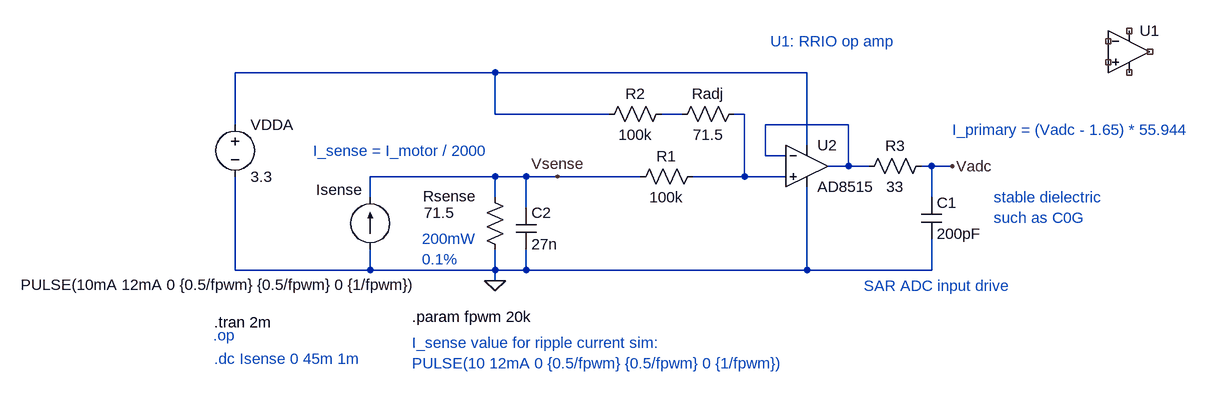
[diagram p0: schematic hallsensor.asc]
hallsensor.asc, the LTspice schematic file:
Version 4
SHEET 1 1144 744
WIRE 48 48 -352 48
WIRE 528 48 48 48
WIRE 48 112 48 48
WIRE 224 112 48 112
WIRE 336 112 304 112
WIRE 432 112 416 112
WIRE -352 128 -352 48
WIRE 592 128 464 128
WIRE 528 160 528 48
WIRE 464 176 464 128
WIRE 496 176 464 176
WIRE 592 192 592 128
WIRE 592 192 560 192
WIRE 624 192 592 192
WIRE 720 192 704 192
WIRE 752 192 720 192
WIRE 48 208 -144 208
WIRE 96 208 48 208
WIRE 144 208 96 208
WIRE 272 208 144 208
WIRE 432 208 432 112
WIRE 432 208 352 208
WIRE 496 208 432 208
WIRE -144 240 -144 208
WIRE 48 240 48 208
WIRE 720 240 720 192
WIRE 96 256 96 208
WIRE -352 352 -352 208
WIRE -144 352 -144 320
WIRE -144 352 -352 352
WIRE 48 352 48 320
WIRE 48 352 -144 352
WIRE 96 352 96 320
WIRE 96 352 48 352
WIRE 528 352 528 224
WIRE 528 352 96 352
WIRE 720 352 720 304
WIRE 720 352 528 352
WIRE 48 368 48 352
FLAG 48 368 0
FLAG 752 192 Vadc
FLAG 144 208 Vsense
SYMBOL current -144 320 R180
WINDOW 0 48 76 Top 2
WINDOW 3 232 -70 Top 2
WINDOW 123 0 0 Left 2
WINDOW 39 0 0 Left 2
SYMATTR InstName Isense
SYMATTR Value PULSE(10mA 12mA 0 {0.5/fpwm} {0.5/fpwm} 0 {1/fpwm})
SYMBOL res 32 224 R0
WINDOW 0 -95 14 Left 2
WINDOW 3 -93 40 Left 2
SYMATTR InstName Rsense
SYMATTR Value 71.5
SYMATTR SpiceLine pwr=0.2
SYMBOL res 368 192 R90
WINDOW 0 0 56 VBottom 2
WINDOW 3 32 56 VTop 2
SYMATTR InstName R1
SYMATTR Value 100k
SYMBOL res 320 96 R90
WINDOW 0 0 56 VBottom 2
WINDOW 3 32 56 VTop 2
SYMATTR InstName R2
SYMATTR Value 100k
SYMBOL res 432 96 R90
WINDOW 0 0 56 VBottom 2
WINDOW 3 32 56 VTop 2
SYMATTR InstName Radj
SYMATTR Value 71.5
SYMBOL voltage -352 112 R0
WINDOW 123 0 0 Left 2
WINDOW 39 0 0 Left 2
SYMATTR InstName VDDA
SYMATTR Value 3.3
SYMBOL Opamps\\UniversalOpamp2 1024 16 R0
SYMATTR InstName U1
SYMATTR Value2 Avol=400k GBW=10Meg Slew=2Meg
SYMATTR SpiceLine ilimit=25m rail=0 Vos=0 phimargin=90
SYMBOL cap 80 256 R0
SYMATTR InstName C2
SYMATTR Value 27n
SYMBOL res 720 176 R90
WINDOW 0 0 56 VBottom 2
WINDOW 3 32 56 VTop 2
SYMATTR InstName R3
SYMATTR Value 33
SYMBOL cap 704 240 R0
SYMATTR InstName C1
SYMATTR Value 200pF
SYMBOL Opamps\\AD8515 528 128 R0
SYMATTR InstName U2
TEXT -384 488 Left 2 ;.dc Isense 0 45m 1m
TEXT -80 424 Left 2 !.param fpwm 20k
TEXT -384 432 Left 2 !.tran 2m
TEXT -80 464 Left 2 ;I_sense value for ripple current sim:\nPULSE(10 12mA 0 {0.5/fpwm} {0.5/fpwm} 0 {1/fpwm})
TEXT -386 452 Left 2 ;.op
TEXT -64 304 Left 2 ;200mW\n0.1%
TEXT 752 136 Left 2 ;I_primary = (Vadc - 1.65) * 55.944
TEXT -232 168 Left 2 ;I_sense = I_motor / 2000
TEXT 472 0 Left 2 ;U1: RRIO op amp
TEXT 616 376 Left 2 ;SAR ADC input drive
TEXT 816 240 Left 2 ;stable dielectric \nsuch as C0G

The netlist it stands for:
* hallsensor.asc
Isense 0 Vsense PULSE(10mA 12mA 0 {0.5/fpwm} {0.5/fpwm} 0 {1/fpwm})
Rsense Vsense 0 71.5 pwr=0.2
R1 N003 Vsense 100k
R2 N002 N001 100k
Radj N003 N002 71.5
VDDA N001 0 3.3
XU1 NC_01 NC_02 NC_03 NC_04 NC_05 level.2 Avol=400k GBW=10Meg Slew=2Meg ilimit=25m rail=0 Vos=0 phimargin=90 en=0 enk=0 in=0 ink=0 Rin=500Meg  ; pins IN+ IN- V+ V- OUT
C2 Vsense 0 27n
R3 Vadc N004 33
C1 Vadc 0 200pF
XU2 N003 N004 N001 0 N004 AD8515  ; pins In+ In- V+ V- OUT
* .dc Isense 0 45m 1m
.param fpwm 20k
.tran 2m
* I_sense value for ripple current sim:
* PULSE(10 12mA 0 {0.5/fpwm} {0.5/fpwm} 0 {1/fpwm})
* .op
* 200mW
* 0.1%
* I_primary = (Vadc - 1.65) * 55.944
* I_sense = I_motor / 2000
* U1: RRIO op amp
* SAR ADC input drive
* stable dielectric
* such as C0G
.lib UniversalOpamps2.sub
.lib ADI.lib
.backanno
.end